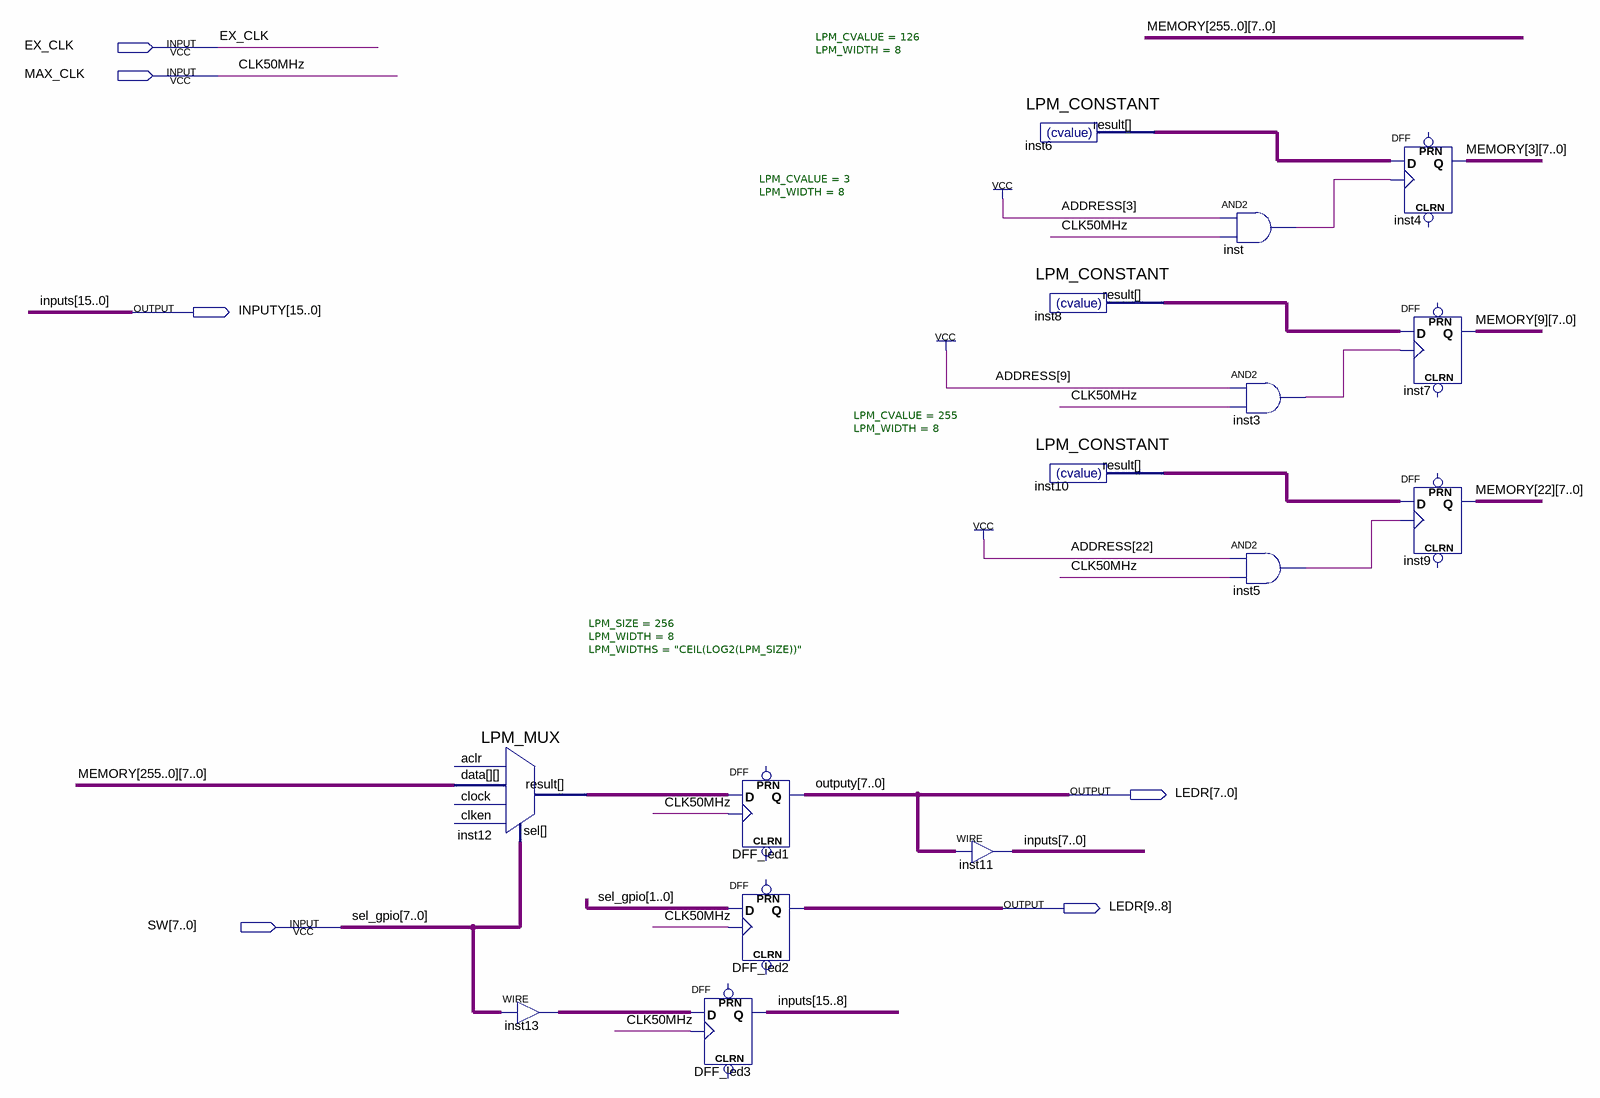
[diagram p0: schematic sheet]
// Quartus schematic BUS_8bit_send.bdf as structural Verilog: 15 symbols, 6 pins
module BUS_8bit_send (
  input  EX_CLK,
  input  MAX_CLK,
  input  [7:0] SW,
  output [15:0] INPUTY,
  output [9:0] LEDR
);

  wire inst3_out, inst5_out, inst_out;
  wire [7:0] inst6_result, inst8_result, inst10_result, inst12_result, inst13_out, MEMORY_0, MEMORY_1,
       MEMORY_2, MEMORY_3, MEMORY_4, MEMORY_5, MEMORY_6, MEMORY_7, MEMORY_8, MEMORY_9, MEMORY_10, MEMORY_11,
       MEMORY_12, MEMORY_13, MEMORY_14, MEMORY_15, MEMORY_16, MEMORY_17, MEMORY_18, MEMORY_19, MEMORY_20,
       MEMORY_21, MEMORY_22, MEMORY_23, MEMORY_24, MEMORY_25, MEMORY_26, MEMORY_27, MEMORY_28, MEMORY_29,
       MEMORY_30, MEMORY_31, MEMORY_32, MEMORY_33, MEMORY_34, MEMORY_35, MEMORY_36, MEMORY_37, MEMORY_38,
       MEMORY_39, MEMORY_40, MEMORY_41, MEMORY_42, MEMORY_43, MEMORY_44, MEMORY_45, MEMORY_46, MEMORY_47,
       MEMORY_48, MEMORY_49, MEMORY_50, MEMORY_51, MEMORY_52, MEMORY_53, MEMORY_54, MEMORY_55, MEMORY_56,
       MEMORY_57, MEMORY_58, MEMORY_59, MEMORY_60, MEMORY_61, MEMORY_62, MEMORY_63, MEMORY_64, MEMORY_65,
       MEMORY_66, MEMORY_67, MEMORY_68, MEMORY_69, MEMORY_70, MEMORY_71, MEMORY_72, MEMORY_73, MEMORY_74,
       MEMORY_75, MEMORY_76, MEMORY_77, MEMORY_78, MEMORY_79, MEMORY_80, MEMORY_81, MEMORY_82, MEMORY_83,
       MEMORY_84, MEMORY_85, MEMORY_86, MEMORY_87, MEMORY_88, MEMORY_89, MEMORY_90, MEMORY_91, MEMORY_92,
       MEMORY_93, MEMORY_94, MEMORY_95, MEMORY_96, MEMORY_97, MEMORY_98, MEMORY_99, MEMORY_100, MEMORY_101,
       MEMORY_102, MEMORY_103, MEMORY_104, MEMORY_105, MEMORY_106, MEMORY_107, MEMORY_108, MEMORY_109,
       MEMORY_110, MEMORY_111, MEMORY_112, MEMORY_113, MEMORY_114, MEMORY_115, MEMORY_116, MEMORY_117,
       MEMORY_118, MEMORY_119, MEMORY_120, MEMORY_121, MEMORY_122, MEMORY_123, MEMORY_124, MEMORY_125,
       MEMORY_126, MEMORY_127, MEMORY_128, MEMORY_129, MEMORY_130, MEMORY_131, MEMORY_132, MEMORY_133,
       MEMORY_134, MEMORY_135, MEMORY_136, MEMORY_137, MEMORY_138, MEMORY_139, MEMORY_140, MEMORY_141,
       MEMORY_142, MEMORY_143, MEMORY_144, MEMORY_145, MEMORY_146, MEMORY_147, MEMORY_148, MEMORY_149,
       MEMORY_150, MEMORY_151, MEMORY_152, MEMORY_153, MEMORY_154, MEMORY_155, MEMORY_156, MEMORY_157,
       MEMORY_158, MEMORY_159, MEMORY_160, MEMORY_161, MEMORY_162, MEMORY_163, MEMORY_164, MEMORY_165,
       MEMORY_166, MEMORY_167, MEMORY_168, MEMORY_169, MEMORY_170, MEMORY_171, MEMORY_172, MEMORY_173,
       MEMORY_174, MEMORY_175, MEMORY_176, MEMORY_177, MEMORY_178, MEMORY_179, MEMORY_180, MEMORY_181,
       MEMORY_182, MEMORY_183, MEMORY_184, MEMORY_185, MEMORY_186, MEMORY_187, MEMORY_188, MEMORY_189,
       MEMORY_190, MEMORY_191, MEMORY_192, MEMORY_193, MEMORY_194, MEMORY_195, MEMORY_196, MEMORY_197,
       MEMORY_198, MEMORY_199, MEMORY_200, MEMORY_201, MEMORY_202, MEMORY_203, MEMORY_204, MEMORY_205,
       MEMORY_206, MEMORY_207, MEMORY_208, MEMORY_209, MEMORY_210, MEMORY_211, MEMORY_212, MEMORY_213,
       MEMORY_214, MEMORY_215, MEMORY_216, MEMORY_217, MEMORY_218, MEMORY_219, MEMORY_220, MEMORY_221,
       MEMORY_222, MEMORY_223, MEMORY_224, MEMORY_225, MEMORY_226, MEMORY_227, MEMORY_228, MEMORY_229,
       MEMORY_230, MEMORY_231, MEMORY_232, MEMORY_233, MEMORY_234, MEMORY_235, MEMORY_236, MEMORY_237,
       MEMORY_238, MEMORY_239, MEMORY_240, MEMORY_241, MEMORY_242, MEMORY_243, MEMORY_244, MEMORY_245,
       MEMORY_246, MEMORY_247, MEMORY_248, MEMORY_249, MEMORY_250, MEMORY_251, MEMORY_252, MEMORY_253,
       MEMORY_254, MEMORY_255;

  LPM_MUX #(.LPM_SIZE(256), .LPM_WIDTH(8), .LPM_WIDTHS("CEIL(LOG2(LPM_SIZE))")) inst12 (
    .data({MEMORY_255, MEMORY_254, MEMORY_253, MEMORY_252, MEMORY_251, MEMORY_250, MEMORY_249, MEMORY_248, MEMORY_247, MEMORY_246, MEMORY_245, MEMORY_244, MEMORY_243, MEMORY_242, MEMORY_241, MEMORY_240, MEMORY_239, MEMORY_238, MEMORY_237, MEMORY_236, MEMORY_235, MEMORY_234, MEMORY_233, MEMORY_232, MEMORY_231, MEMORY_230, MEMORY_229, MEMORY_228, MEMORY_227, MEMORY_226, MEMORY_225, MEMORY_224, MEMORY_223, MEMORY_222, MEMORY_221, MEMORY_220, MEMORY_219, MEMORY_218, MEMORY_217, MEMORY_216, MEMORY_215, MEMORY_214, MEMORY_213, MEMORY_212, MEMORY_211, MEMORY_210, MEMORY_209, MEMORY_208, MEMORY_207, MEMORY_206, MEMORY_205, MEMORY_204, MEMORY_203, MEMORY_202, MEMORY_201, MEMORY_200, MEMORY_199, MEMORY_198, MEMORY_197, MEMORY_196, MEMORY_195, MEMORY_194, MEMORY_193, MEMORY_192, MEMORY_191, MEMORY_190, MEMORY_189, MEMORY_188, MEMORY_187, MEMORY_186, MEMORY_185, MEMORY_184, MEMORY_183, MEMORY_182, MEMORY_181, MEMORY_180, MEMORY_179, MEMORY_178, MEMORY_177, MEMORY_176, MEMORY_175, MEMORY_174, MEMORY_173, MEMORY_172, MEMORY_171, MEMORY_170, MEMORY_169, MEMORY_168, MEMORY_167, MEMORY_166, MEMORY_165, MEMORY_164, MEMORY_163, MEMORY_162, MEMORY_161, MEMORY_160, MEMORY_159, MEMORY_158, MEMORY_157, MEMORY_156, MEMORY_155, MEMORY_154, MEMORY_153, MEMORY_152, MEMORY_151, MEMORY_150, MEMORY_149, MEMORY_148, MEMORY_147, MEMORY_146, MEMORY_145, MEMORY_144, MEMORY_143, MEMORY_142, MEMORY_141, MEMORY_140, MEMORY_139, MEMORY_138, MEMORY_137, MEMORY_136, MEMORY_135, MEMORY_134, MEMORY_133, MEMORY_132, MEMORY_131, MEMORY_130, MEMORY_129, MEMORY_128, MEMORY_127, MEMORY_126, MEMORY_125, MEMORY_124, MEMORY_123, MEMORY_122, MEMORY_121, MEMORY_120, MEMORY_119, MEMORY_118, MEMORY_117, MEMORY_116, MEMORY_115, MEMORY_114, MEMORY_113, MEMORY_112, MEMORY_111, MEMORY_110, MEMORY_109, MEMORY_108, MEMORY_107, MEMORY_106, MEMORY_105, MEMORY_104, MEMORY_103, MEMORY_102, MEMORY_101, MEMORY_100, MEMORY_99, MEMORY_98, MEMORY_97, MEMORY_96, MEMORY_95, MEMORY_94, MEMORY_93, MEMORY_92, MEMORY_91, MEMORY_90, MEMORY_89, MEMORY_88, MEMORY_87, MEMORY_86, MEMORY_85, MEMORY_84, MEMORY_83, MEMORY_82, MEMORY_81, MEMORY_80, MEMORY_79, MEMORY_78, MEMORY_77, MEMORY_76, MEMORY_75, MEMORY_74, MEMORY_73, MEMORY_72, MEMORY_71, MEMORY_70, MEMORY_69, MEMORY_68, MEMORY_67, MEMORY_66, MEMORY_65, MEMORY_64, MEMORY_63, MEMORY_62, MEMORY_61, MEMORY_60, MEMORY_59, MEMORY_58, MEMORY_57, MEMORY_56, MEMORY_55, MEMORY_54, MEMORY_53, MEMORY_52, MEMORY_51, MEMORY_50, MEMORY_49, MEMORY_48, MEMORY_47, MEMORY_46, MEMORY_45, MEMORY_44, MEMORY_43, MEMORY_42, MEMORY_41, MEMORY_40, MEMORY_39, MEMORY_38, MEMORY_37, MEMORY_36, MEMORY_35, MEMORY_34, MEMORY_33, MEMORY_32, MEMORY_31, MEMORY_30, MEMORY_29, MEMORY_28, MEMORY_27, MEMORY_26, MEMORY_25, MEMORY_24, MEMORY_23, MEMORY_22, MEMORY_21, MEMORY_20, MEMORY_19, MEMORY_18, MEMORY_17, MEMORY_16, MEMORY_15, MEMORY_14, MEMORY_13, MEMORY_12, MEMORY_11, MEMORY_10, MEMORY_9, MEMORY_8, MEMORY_7, MEMORY_6, MEMORY_5, MEMORY_4, MEMORY_3, MEMORY_2, MEMORY_1, MEMORY_0}),
    .sel(SW), .result(inst12_result));  // open: clock, aclr, clken
  assign inst13_out = SW;  // WIRE inst13
  DFF DFF_led3[7:0] (.CLK(MAX_CLK), .D(inst13_out), .Q(INPUTY[15:8]));  // open: CLRN, PRN
  DFF DFF_led1[7:0] (.CLK(MAX_CLK), .D(inst12_result), .Q(LEDR[7:0]));  // open: CLRN, PRN
  DFF DFF_led2[1:0] (.CLK(MAX_CLK), .D(SW[1:0]), .Q(LEDR[9:8]));  // open: CLRN, PRN
  assign INPUTY[7:0] = LEDR[7:0];  // WIRE inst11
  LPM_CONSTANT #(.LPM_CVALUE(126), .LPM_WIDTH(8)) inst6 (.result(inst6_result));
  LPM_CONSTANT #(.LPM_CVALUE(3), .LPM_WIDTH(8)) inst8 (.result(inst8_result));
  LPM_CONSTANT #(.LPM_CVALUE(255), .LPM_WIDTH(8)) inst10 (.result(inst10_result));
  and inst (inst_out, 1'b1, MAX_CLK);
  and inst3 (inst3_out, 1'b1, MAX_CLK);
  and inst5 (inst5_out, 1'b1, MAX_CLK);
  DFF inst4[7:0] (.CLK(inst_out), .D(inst6_result), .Q(MEMORY_3));  // open: CLRN, PRN
  DFF inst7[7:0] (.CLK(inst3_out), .D(inst8_result), .Q(MEMORY_9));  // open: CLRN, PRN
  DFF inst9[7:0] (.CLK(inst5_out), .D(inst10_result), .Q(MEMORY_22));  // open: CLRN, PRN

  // Other names for the same wires on the sheet: CLK50MHz = MAX_CLK; inputs[15:0] = INPUTY; outputy[7:0] = LEDR[7:0];
  //   sel_gpio[7:0] = SW
endmodule
